# Altium schematic sheet karmanDB_mem.SchDoc
size A
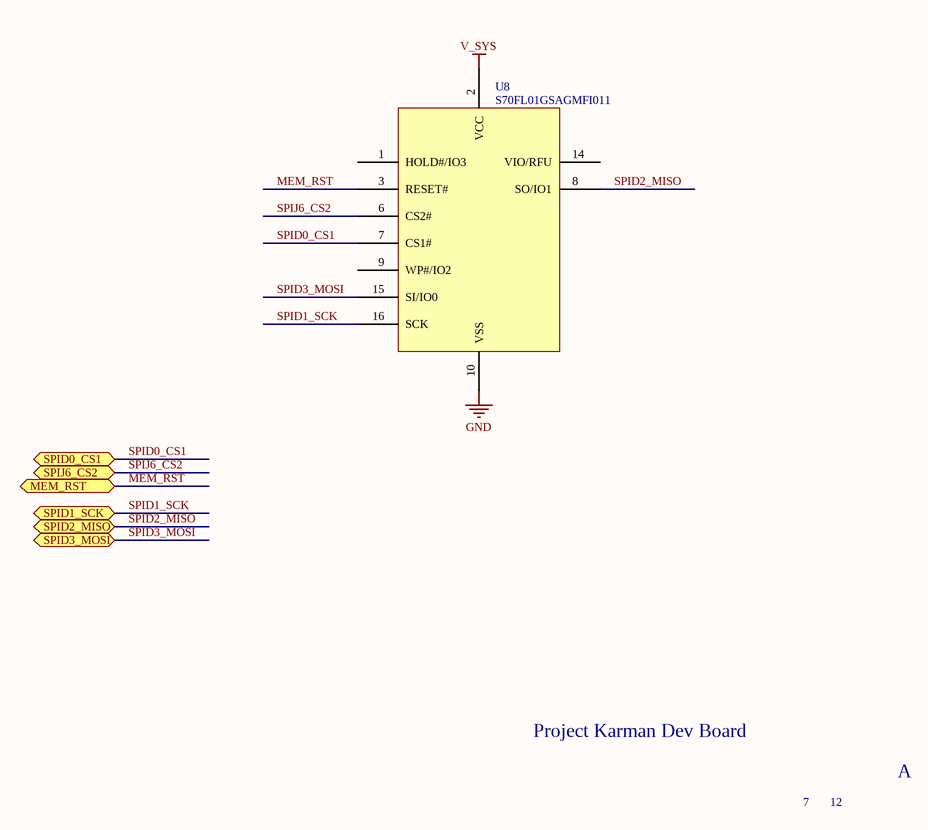
[diagram p0: karmanDB_mem.SchDoc]

## Parts
U8  S70FL01GSAGMFI011  [15 S70FL01GSAGMFI011]

## Ports
MEM_RST (bidir), SPID0_CS1 (bidir), SPID1_SCK (bidir), SPID2_MISO (bidir), SPID3_MOSI (bidir), SPIJ6_CS2 (bidir)

## Nets
GND: U8.10(VSS)
V_SYS: U8.2(VCC)
MEM_RST: U8.3(RESET#) ; port MEM_RST
SPID0_CS1: U8.7(CS1#) ; port SPID0_CS1
SPID1_SCK: U8.16(SCK) ; port SPID1_SCK
SPID2_MISO: U8.8(SO/IO1) ; port SPID2_MISO
SPID3_MOSI: U8.15(SI/IO0) ; port SPID3_MOSI
SPIJ6_CS2: U8.6(CS2#) ; port SPIJ6_CS2

Not connected (* = marked no-connect by the designer): U8 1(HOLD#/IO3) 9(WP#/IO2) 14(VIO/RFU)

## Notes on the sheet
- Project Karman Dev Board
- 7
- 12
- A

## Library data of the parts
U8 = S70FL01GSAGMFI011: IC FLASH 1GBIT 133MHZ 16SOIC; Manufacturer: Spansion; Memory Type: FLASH - NOR; Memory Size: 1G (128M x 8); Interface: SPI Serial; Voltage - Supply: 2.7 V ~ 3.6 V; Supplier 1: Digi-Key; Manufacturer Part Number: S70FL01GSAGMFI011; RoHS: RoHS Compliant; Category: Integrated Circuits (ICs); Stock 1: 1899; Pricing 1: 1=10.35, 10=9.584, 50=9.3154, 100=8.4455 (USD); Packaging: Tube; Format - Memory: FLASH; Speed: 133MHz; Operating Temperature: -40°C ~ 85°C; Package / Case: 16-SOIC (0.295", 7.50mm Width); Supplier Device Package: 16-SOIC; ComponentLink1URL: http://www.spansion.com/Support/Datasheets/S70FL01GS.pdf; ComponentLink1Description: http://www.spansion.com/Support/Datasheets/S70FL01GS.pdf; Supplier Part Number 1: 1274-1092-ND